# EAGLE design jbee_jn_unten (EAGLE 5.11)
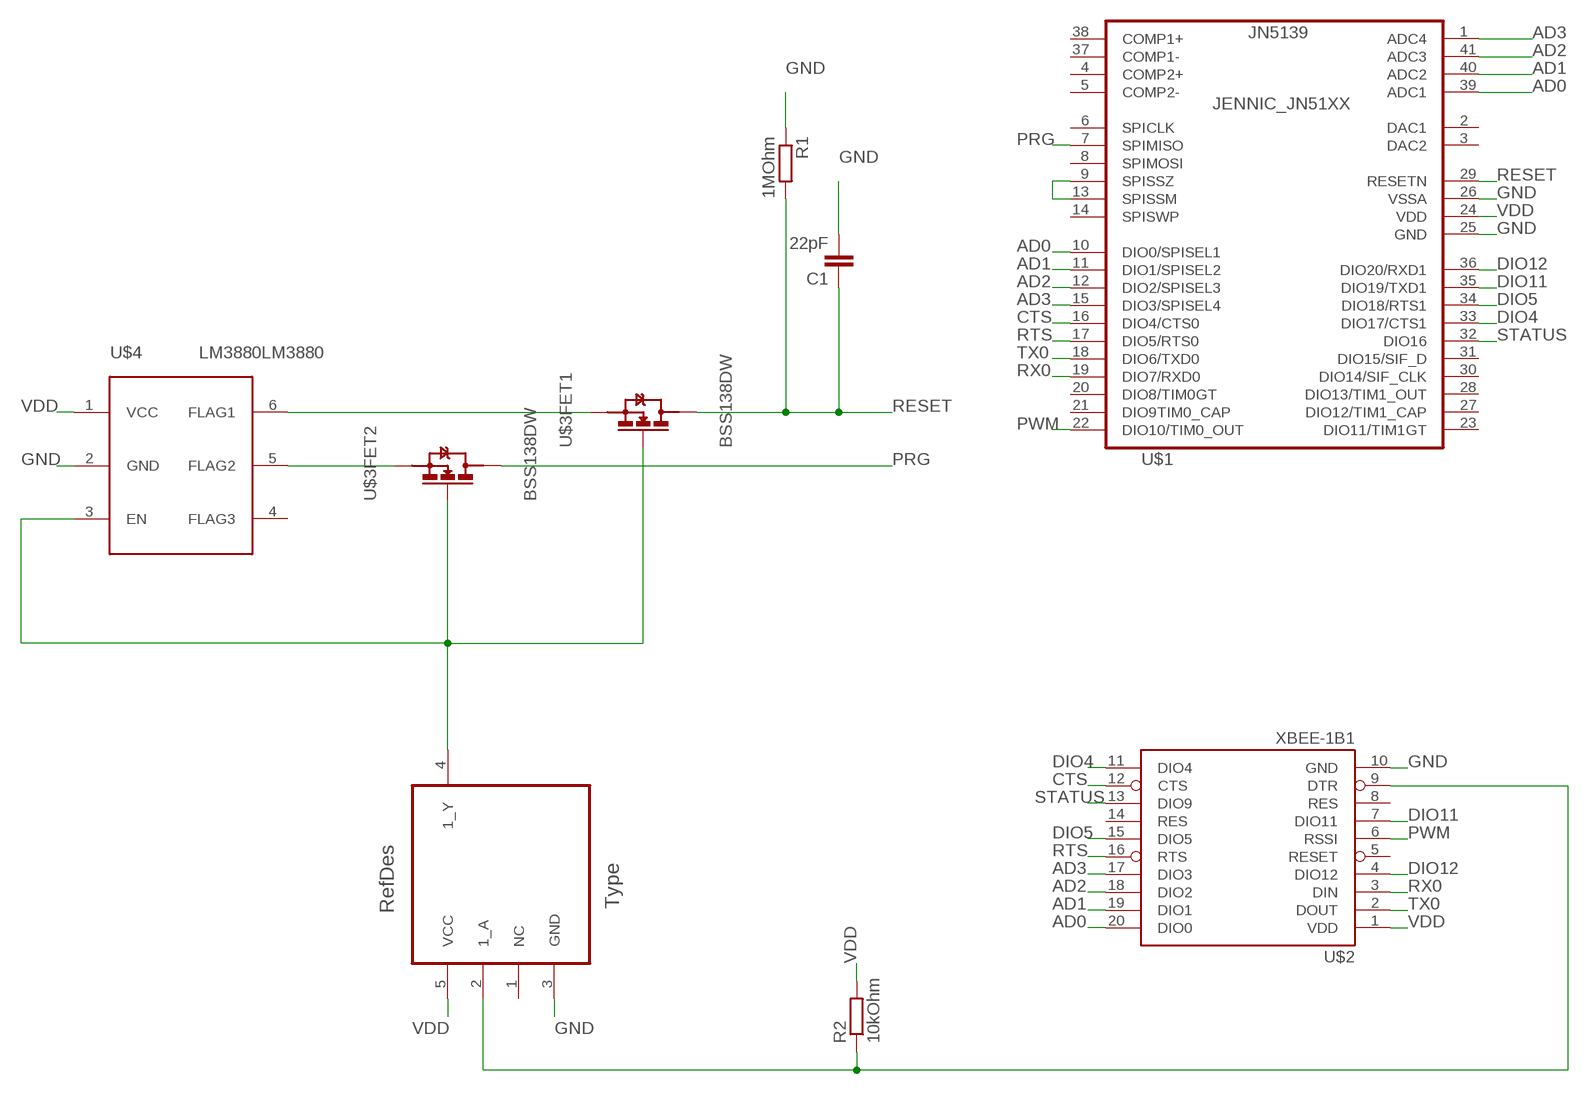
[diagram p0: schematic, sheet 1]

## Parts
C1  22pF  C-EUC0603  [C0603]
R1  1MOhm  R-EU_R0603  [R0603]
R2  10kOhm  R-EU_R0603  [R0603]
U1  74V1G14STR  [SOT95P290X145-5N]
U$1  JENNIC_JN51XX  [JN5139_SMD]
U$2  XBEE-1B1  [XBEE-1]
U$3  BSS138DW  [SOT-363]
U$4  LM3880LM3880  [SOT23-6]

## Nets
AD0: U$1.10(DIO0/SPISEL1) U$1.39(ADC1) U$2.20(DIO0)
AD1: U$1.11(DIO1/SPISEL2) U$1.40(ADC2) U$2.19(DIO1)
AD2: U$1.12(DIO2/SPISEL3) U$1.41(ADC3) U$2.18(DIO2)
AD3: U$1.1(ADC4) U$1.15(DIO3/SPISEL4) U$2.17(DIO3)
CTS: U$1.16(DIO4/CTS0) U$2.12(CTS)
DIO4: U$1.33(DIO17/CTS1) U$2.11(DIO4)
DIO5: U$1.34(DIO18/RTS1) U$2.15(DIO5)
DIO11: U$1.35(DIO19/TXD1) U$2.7(DIO11)
DIO12: U$1.36(DIO20/RXD1) U$2.4(DIO12)
GND: C1.2 R1.1 U1.3(GND) U$1.25(GND) U$1.26(VSSA) U$2.10(GND) U$4.2(GND)
N$1: U$3.4(FET1:S) U$4.6(FLAG1)
N$2: U1.4(1_Y) U$3.2(FET2:G) U$3.5(FET1:G) U$4.3(EN)
N$7: U$1.9(SPISSZ) U$1.13(SPISSM)
N$11: U$3.1(FET2:S) U$4.5(FLAG2)
N$12: R2.1 U1.2(1_A) U$2.9(DTR)
PRG: U$1.7(SPIMISO) U$3.6(FET2:D)
PWM: U$1.22(DIO10/TIM0_OUT) U$2.6(RSSI)
RESET: C1.1 R1.2 U$1.29(RESETN) U$3.3(FET1:D)
RTS: U$1.17(DIO5/RTS0) U$2.16(RTS)
RX0: U$1.19(DIO7/RXD0) U$2.3(DIN)
STATUS: U$1.32(DIO16) U$2.13(DIO9)
TX0: U$1.18(DIO6/TXD0) U$2.2(DOUT)
VDD: R2.2 U1.5(VCC) U$1.24(VDD) U$2.1(VDD) U$4.1(VCC)
Unconnected: U1.1(NC) U$1.2(DAC1) U$1.3(DAC2) U$1.4(COMP2+) U$1.5(COMP2-) U$1.6(SPICLK) U$1.8(SPIMOSI) U$1.14(SPISWP) U$1.20(DIO8/TIM0GT) U$1.21(DIO9TIM0_CAP) U$1.23(DIO11/TIM1GT) U$1.27(DIO12/TIM1_CAP) U$1.28(DIO13/TIM1_OUT) U$1.30(DIO14/SIF_CLK) U$1.31(DIO15/SIF_D) U$1.37(COMP1-) U$1.38(COMP1+) U$2.5(RESET) U$2.8(RES) U$2.14(RES) U$4.4(FLAG3)

## Library data of the parts
C1 = rcl:C-EU: CAPACITOR, European symbol
R1 R2 = rcl:R-EU_: RESISTOR, European symbol
U1 = inverter:74V1G14STR; DESCRIPTION: SINGLE SCHMITT INVERTER; MPN: 74V1G14STR; OC_FARNELL: 1288476; OC_NEWARK: 89K1197; PACKAGE: SOT-23-5; SUPPLIER: STMICROELECTRONICS
U$1 = jnode:JENNIC_JN51XX: JN5139-xxx-M00xxx, Farnell: 1500175
U$2 = SparkFun:XBEE-1
U$3 = sonder_b:BSS138DW: BSS138DW DUAL N-CHANNEL ENHANCEMENT MODE FIELD EFFECT TRANSISTOR SOT-363 Package
U$4 = lm3881:LM3880

## Board
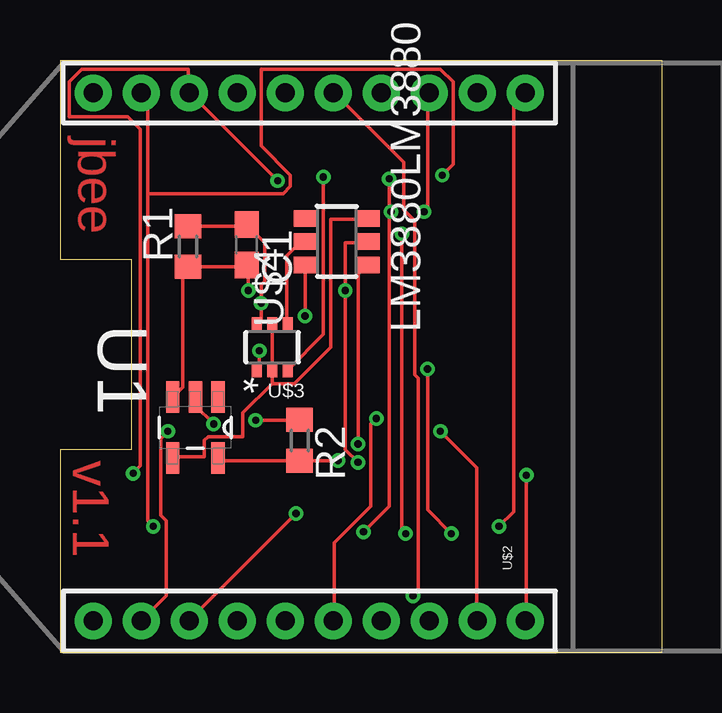
[diagram p1: board, top side]
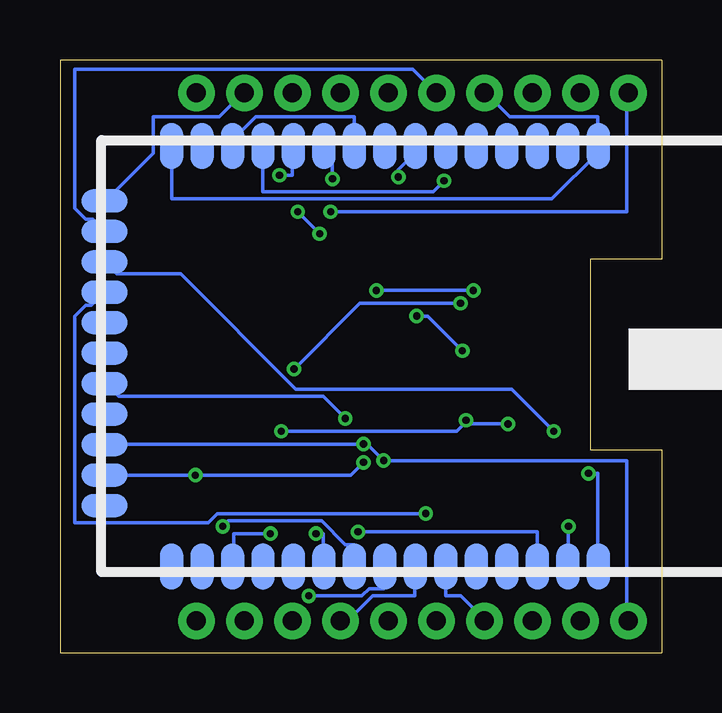
[diagram p2: board, bottom side, seen from below]

Size 25.07 x 24.69 mm. Coordinates in mm from the lower left corner, seen from the top.
Outline: 0,24.69 25.07,24.69 25.07,0 0,0 0,8.46 2.97,8.46 2.97,16.38 0,16.38 0,24.69
Copper layers (1*16): Top 0.035mm / dielectric 1.5mm / Bottom 0.035mm
Design rules "PCB-POOL Standard *": minimum track width 0.15mm, minimum drill 0.3mm, track to track 0.15mm, track to pad 0.15mm, pad to pad 0.15mm, via to via 0.15mm, smd to smd 0.15mm, copper to edge 0.3mm, drill to drill 0.2mm, minimum pad ring 0.2mm, minimum via ring 0.15mm, stop-mask expansion 0.075mm, vias tented up to drill 15mil, thermal gap 0.2mm

### Footprints (pad centres in the part's own frame; a part is rotated, then mirrored left to right if it is on the bottom)
C0603 = smd 1.1 x 1: 1 -0.85,0; 2 0.85,0
R0603 = smd 1 x 1.1: 1 -0.85,0; 2 0.85,0
SOT95P290X145-5N = smd 1.321 x 0.559: 1 -1.27,0.94; 2 -1.27,0; 3 -1.27,-0.94; 4 1.27,-0.94; 5 1.27,0.94
JN5139_SMD = smd 1.93 x 0.965: 1 0,0; 2 0,-1.27; 3 0,-2.54; 4 0,-3.81; 5 0,-5.08; 6 0,-6.35; 7 0,-7.62; 8 0,-8.89; 9 0,-10.16; 10 0,-11.43; 11 0,-12.7; 12 0,-13.97; 13 0,-15.24; 14 0,-16.51; 15 0,-17.78; 27 17.526,-17.78; 28 17.526,-16.51; 29 17.526,-15.24; 30 17.526,-13.97; 31 17.526,-12.7; 32 17.526,-11.43; 33 17.526,-10.16; 34 17.526,-8.89; 35 17.526,-7.62; 36 17.526,-6.35; 37 17.526,-5.08; 38 17.526,-3.81; 39 17.526,-2.54; 40 17.526,-1.27; 41 17.526,0 | smd 0.965 x 1.93: 16 2.286,-20.574; 17 3.556,-20.574; 18 4.826,-20.574; 19 6.096,-20.574; 20 7.366,-20.574; 21 8.636,-20.574; 22 9.906,-20.574; 23 11.176,-20.574; 24 12.446,-20.574; 25 13.716,-20.574; 26 14.986,-20.574
XBEE-1 = drill 0.8 pad 1.524 round: 1 -11,20; 2 -11,18; 3 -11,16; 4 -11,14; 5 -11,12; 6 -11,10; 7 -11,8; 8 -11,6; 9 -11,4; 10 -11,2; 11 11,2; 12 11,4; 13 11,6; 14 11,8; 15 11,10; 16 11,12; 17 11,14; 18 11,16; 19 11,18; 20 11,20
SOT-363 = smd 0.42 x 0.6: 1 -0.65,-0.95; 2 0,-0.95; 3 0.65,-0.95; 4 0.65,0.95; 5 0,0.95; 6 -0.65,0.95
SOT23-6 = smd 0.686 x 0.991: 1 -0.965,-1.321; 2 0,-1.321; 3 0.965,-1.321; 4 0.965,1.27; 5 0,1.27; 6 -0.965,1.27

### Placement (x,y rotation side)
C1  7.77,16.99 270 top
R1  5.33,16.92 90 top
R2  9.98,8.84 270 top
U1  5.64,9.37 270 top
U$1  2.64,21.11 270 bottom
U$2  21.39,12.32 90 top
U$3  8.84,12.73 180 top
U$4  11.51,17.12 90 top

### Tracks (layer width: path | path; a pad name or v marks a point on that pad's centre or on a via)
AD0  (via drill 0.3)
  Top 0.15: v12.65,5.03 13.72,6.1 13.72,18.36 | 13.72,18.36 v13.72,19.74 | 13.72,18.36 v13.79,18.36
  Bottom 0.15: U$1.39 5.18,5.03 v12.65,5.03 | v13.72,19.74 13.72,21.11 U$1.10 | v13.79,18.36 1.45,18.36 1.45,23.32 U$2.20
AD1  (via drill 0.3)
  Top 0.15: v3.89,5.26 3.66,5.49 3.66,19.13 | 3.66,19.13 3.66,23.09 3.43,23.32 U$2.19 | v15.93,19.89 16.38,20.35 16.38,23.77 15.85,24.31 8.38,24.31 8.38,21.11 9.6,19.89 9.6,19.43 9.3,19.13 3.66,19.13
  Bottom 0.15: v3.89,5.26 3.89,3.58 U$1.40 | v15.93,19.89 15.39,19.89 15.39,21.11 U$1.11
AD2  (via drill 0.3)
  Top 0.15: v3.05,7.47 3.35,7.77 3.35,21.79 2.82,22.33 0.38,22.33 0.38,23.77 0.91,24.31 5.33,24.31 5.33,23.39 U$2.18 5.41,23.32 v9.07,19.66
  Bottom 0.15: v3.05,7.47 2.67,7.47 2.67,3.58 U$1.41 | U$1.12 16.61,19.2 9.52,19.2 v9.07,19.66
AD3
  Bottom 0.15: 2.67,21.11 2.67,22.33 6.32,22.33 7.32,23.32 U$2.17 | U$1.15 20.42,18.9 4.57,18.9 2.67,20.8 2.67,21.11 | U$1.1 2.67,21.11
CTS
  Bottom 0.15: U$1.16 23.16,18.82 21.18,20.8 21.18,22.33 18.44,22.33 17.45,23.32 U$2.12
DIO4  (via drill 0.3)
  Top 0.15: v18.29,5.26 18.9,5.87 18.9,22.86 19.35,23.32 U$2.11
  Bottom 0.15: U$1.33 12.8,4.5 13.18,4.5 14.17,5.49 18.06,5.49 v18.29,5.26
DIO5  (via drill 0.3)
  Top 0.15: v14.71,2.36 14.94,2.59 14.94,11.43 14.78,11.58 14.78,17.98 14.33,18.44 14.33,20.42 11.43,23.32 U$2.15
  Bottom 0.15: v14.71,2.36 12.5,2.36 12.19,2.67 11.58,2.67 11.58,3.58 U$1.34
DIO11
  Bottom 0.15: U$1.35 10.29,3.58 10.29,2.36 12.04,2.36 13.03,1.37 13.33,1.37 U$2.7
DIO12
  Bottom 0.15: U$1.36 8.99,2.36 8.38,2.36 7.39,1.37 U$2.4
GND  (via drill 0.3)
  Top 0.15: 7.77,16.08 5.33,16.08 R1.1 5.33,16 5.11,15.77 5.11,11.05 U1.3 | v12.42,7.93 11.89,8.46 v11.89,15.09 11.89,17.07 12.8,17.07 U$4.2 | v19.43,7.39 19.43,1.37 U$2.10 | 7.77,16.08 7.85,16 v7.85,15.09 | 7.77,16.08 C1.2
  Bottom 0.15: v12.42,7.93 12.95,7.39 v19.43,7.39 U$1.25 23.24,7.39 23.24,6.17 U$1.26 | v7.85,15.09 v11.89,15.09
N$1  (via drill 0.3)
  Top 0.15: v8.31,12.57 8.31,11.89 8.23,11.81 U$3.4 | v10.21,14.02 10.21,16.15 U$4.6
  Bottom 0.15: v8.31,12.57 9.75,14.02 v10.21,14.02
N$2
  Top 0.15: U$3.2 U$3.5 8.84,11.2 | 8.84,11.2 9.75,11.2 11.28,12.73 11.28,18.06 12.8,18.06 U$4.3 | 8.84,11.2 7.62,9.98 7.62,8.99 6.17,8.99 6.02,8.84 6.02,8.15 4.72,8.15 U1.4
N$7
  Bottom 0.15: U$1.9 12.8,22.33 16.92,22.33 17.83,21.41 17.83,21.11 U$1.13
N$11
  Top 0.15: U$3.1 9.45,13.72 9.45,16.54 9.98,17.07 10.21,17.07 U$4.5
N$12  (via drill 0.3)
  Top 0.15: v8.15,9.68 R2.1 | v6.4,9.53 5.64,10.29 U1.2 | v15.85,9.22 17.37,7.7 17.37,1.37 U$2.9
  Bottom 0.15: v6.4,9.53 8,9.53 v8.15,9.68 8.15,9.6 8.53,9.22 v15.85,9.22
PRG  (via drill 0.3)
  Top 0.15: v10.97,19.81 10.97,13.26 9.52,11.81 U$3.6
  Bottom 0.15: v10.97,19.81 10.97,20.12 10.29,20.8 10.29,21.11 U$1.7
PWM  (via drill 0.3)
  Top 0.15: v13.18,9.75 12.95,9.53 12.95,6.1 11.43,4.57 11.43,1.37 U$2.6
  Bottom 0.15: v13.18,9.75 14.1,10.67 22.63,10.67 23.16,11.2 U$1.22
RESET  (via drill 0.3)
  Top 0.15: U$3.3 8.23,13.72 8.38,13.87 v8.38,14.55 8.38,15.32 8.53,15.47 8.53,17.07 7.77,17.83 C1.1 7.77,17.75 5.33,17.75 R1.2 | v16.31,4.95 15.32,5.94 v15.32,11.81
  Bottom 0.15: v16.31,4.95 17.83,4.95 17.83,3.58 U$1.29 | v15.32,11.81 12.57,14.55 v8.38,14.55
RTS
  Bottom 0.15: U$1.17 23.24,17.6 23.7,18.06 24,18.06 24.46,18.52 24.46,24.31 10.36,24.31 9.45,23.39 U$2.16
RX0  (via drill 0.3)
  Top 0.15: v9.83,5.79 5.41,1.37 U$2.3
  Bottom 0.15: v9.83,5.79 18.52,5.79 18.9,5.41 24.46,5.41 24.46,14.02 24,14.48 23.77,14.48 23.24,15.01 U$1.19
STATUS  (via drill 0.3)
  Top 0.15: v14.4,4.95 14.25,5.11 v14.25,17.45 | v15.16,18.36 15.32,18.52 15.32,23.32 U$2.13
  Bottom 0.15: v14.4,4.95 14.1,4.95 14.1,3.58 U$1.32 | v14.25,17.45 v15.16,18.36
TX0  (via drill 0.3)
  Top 0.15: v4.5,9.22 4.19,8.92 4.19,5.72 4.42,5.49 4.42,2.36 3.43,1.37 U$2.2
  Bottom 0.15: v4.5,9.22 6.25,10.97 15.24,10.97 20.04,15.77 22.71,15.77 U$1.18
VDD  (via drill 0.3)
  Top 0.15: 9.98,8 6.63,8 6.63,8.08 U1.5 | v12.42,8.69 12.42,15.77 12.8,16.15 U$4.1 | v11.58,8 9.98,8 | 9.98,8 R2.2
  Bottom 0.15: U$1.24 23.16,8.69 v12.42,8.69 12.27,8.69 v11.58,8 1.45,8 1.45,1.37 U$2.1

### Text on the board
Top: jbee | v1.1